# Altium schematic sheet SCH3_Microcontroller.SchDoc
size B; Organization: CWRUbotix; Address1: 10900 Euclid Avenue; Address2: Cleveland, OH 44106; Address3: USA
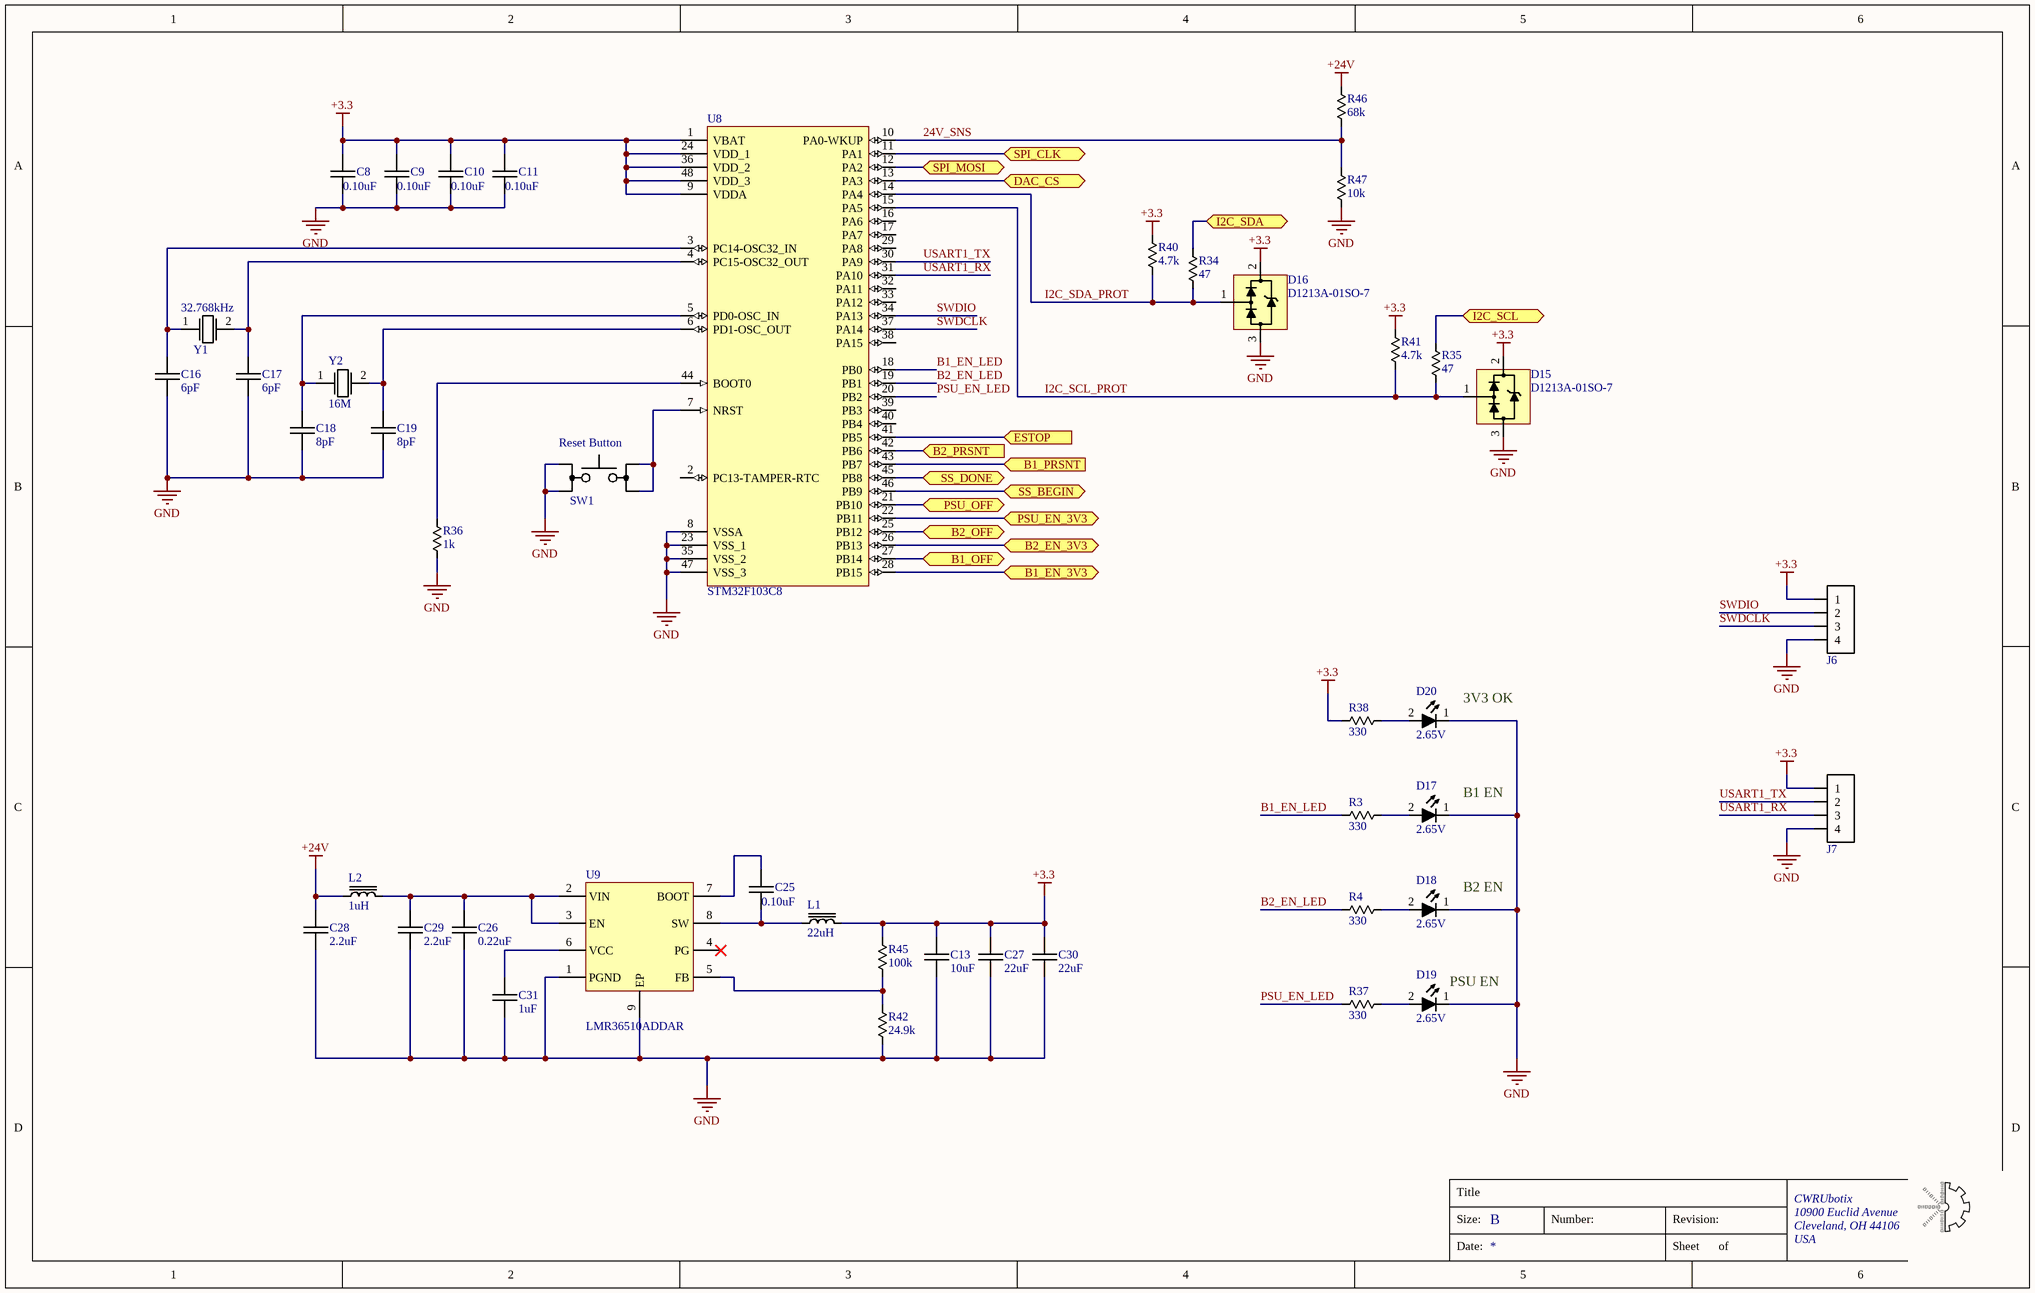
[diagram p0: SCH3_Microcontroller.SchDoc]

## Parts
C8  0.10uF  [chip_0805]
C9  0.10uF  [chip_0805]
C10  0.10uF  [chip_0805]
C11  0.10uF  [chip_0805]
C13  10uF  [chip_1206]
C16  6pF  [chip_0603]
C17  6pF  [chip_0603]
C18  8pF  [chip_0603]
C19  8pF  [chip_0603]
C25  0.10uF  [chip_0805]
C26  0.22uF  [chip_0805]
C27  22uF  [chip_1206]
C28  2.2uF  [chip_1206]
C29  2.2uF  [chip_1206]
C30  22uF  [chip_1206]
C31  1uF  [chip_0805]
D15  D1213A-01SO-7  [SOT-23-3_1]
D16  D1213A-01SO-7  [SOT-23-3_1]
D17  2.65V  [chip_0603_LED]
D18  2.65V  [chip_0603_LED]
D19  2.65V  [chip_0603_LED]
D20  2.65V  [chip_0603_LED]
J6  conn-4x1_0  [HDDR_4x1_0]  (value not drawn)
J7  conn-4x1_0  [HDDR_4x1_0]  (value not drawn)
L1  22uH  [BOURNS_SRN5040]
L2  1uH  [chip_0805]
R3  330  [chip_0805]
R4  330  [chip_0805]
R34  47  [chip_0805]
R35  47  [chip_0805]
R36  1k  [chip_0805]
R37  330  [chip_0805]
R38  330  [chip_0805]
R40  4.7k  [chip_0805]
R41  4.7k  [chip_0805]
R42  24.9k  [chip_0805]
R45  100k  [chip_0805]
R46  68k  [chip_0805]
R47  10k  [chip_0805]
SW1  SW_1P1T_2  [TE_CONN_3-1825910-5]  (value not drawn)
U8  STM32F103C8  [LQFP48_0]
U9  LMR36510ADDAR  [SO-8_PPAD]
Y1  osc_xtal_2p_0  [ABS25_OSC]  (value not drawn)
Y2  16M  [NX5032GA]

## Ports
B1_EN_3V3 (bidir), B1_OFF (bidir), B1_PRSNT (in), B2_EN_3V3 (bidir), B2_OFF (bidir), B2_PRSNT (in), DAC_CS (bidir), ESTOP (in), I2C_SCL (bidir), I2C_SDA (bidir), PSU_EN_3V3 (bidir), PSU_OFF (bidir), SPI_CLK (bidir), SPI_MOSI (bidir), SS_BEGIN (bidir), SS_DONE (bidir)

## Nets
+3.3: C8.1 C9.1 C10.1 C11.1 C13.1 C27.1 C30.1 D15.2(VCC) D16.2(VCC) J6.1 J7.1 L1.2 R38.1 R40.1 R41.1 R45.2 U8.1(VBAT) U8.9(VDDA) U8.24(VDD_1) U8.36(VDD_2) U8.48(VDD_3)
+24V: C28.1 L2.1 R46.1
GND: C8.2 C9.2 C10.2 C11.2 C13.2 C16.2 C17.2 C18.2 C19.2 C26.2 C27.2 C28.2 C29.2 C30.2 C31.2 D15.3(GND) D16.3(GND) D17.1 D18.1 D19.1 D20.1 J6.4 J7.4 R36.2 R42.2 R47.2 SW1.1 SW1.2 U8.8(VSSA) U8.23(VSS_1) U8.35(VSS_2) U8.47(VSS_3) U9.1(PGND) U9.9(EP)
24V_SNS: R46.2 R47.1 U8.10(PA0-WKUP)
B1_EN_3V3: U8.28(PB15) ; port B1_EN_3V3
B1_EN_LED: R3.1 U8.18(PB0)
B1_OFF: U8.27(PB14) ; port B1_OFF
B1_PRSNT: U8.43(PB7) ; port B1_PRSNT
B2_EN_3V3: U8.26(PB13) ; port B2_EN_3V3
B2_EN_LED: R4.1 U8.19(PB1)
B2_OFF: U8.25(PB12) ; port B2_OFF
B2_PRSNT: U8.42(PB6) ; port B2_PRSNT
DAC_CS: U8.13(PA3) ; port DAC_CS
ESTOP: U8.41(PB5) ; port ESTOP
I2C_SCL: R35.2 ; port I2C_SCL
I2C_SCL_PROT: D15.1(LINE) R35.1 R41.2 U8.15(PA5)
I2C_SDA: R34.2 ; port I2C_SDA
I2C_SDA_PROT: D16.1(LINE) R34.1 R40.2 U8.14(PA4)
PSU_EN_3V3: U8.22(PB11) ; port PSU_EN_3V3
PSU_EN_LED: R37.1 U8.20(PB2)
PSU_OFF: U8.21(PB10) ; port PSU_OFF
SPI_CLK: U8.11(PA1) ; port SPI_CLK
SPI_MOSI: U8.12(PA2) ; port SPI_MOSI
SS_BEGIN: U8.46(PB9) ; port SS_BEGIN
SS_DONE: U8.45(PB8) ; port SS_DONE
SWDCLK: J6.3 U8.37(PA14)
SWDIO: J6.2 U8.34(PA13)
USART1_RX: J7.3 U8.31(PA10)
USART1_TX: J7.2 U8.30(PA9)
NetC16_1: C16.1 U8.3(PC14-OSC32_IN) Y1.1
NetC17_1: C17.1 U8.4(PC15-OSC32_OUT) Y1.2
NetC18_1: C18.1 U8.5(PD0-OSC_IN) Y2.1
NetC19_1: C19.1 U8.6(PD1-OSC_OUT) Y2.2
NetC25_1: C25.1 U9.7(BOOT)
NetC25_2: C25.2 L1.1 U9.8(SW)
NetC26_1: C26.1 C29.1 L2.2 U9.2(VIN) U9.3(EN)
NetC31_1: C31.1 U9.6(VCC)
NetD17_2: D17.2 R3.2
NetD18_2: D18.2 R4.2
NetD19_2: D19.2 R37.2
NetD20_2: D20.2 R38.2
NetR36_1: R36.1 U8.44(BOOT0)
NetR42_1: R42.1 R45.1 U9.5(FB)
NetSW1_3: SW1.3 SW1.4 U8.7(NRST)

Not connected (* = marked no-connect by the designer): U8 2(PC13-TAMPER-RTC) 16(PA6) 17(PA7) 29(PA8) 32(PA11) 33(PA12) 38(PA15) 39(PB3) 40(PB4); U9 4(PG)*

## Notes on the sheet
- (near Y1) 32.768kHz
- (near SW1) Reset Button
- (near D20) 3V3 OK
- (near D17) B1 EN
- (near D18) B2 EN
- (near D19) PSU EN
- Title
- Size:
- B
- Number:
- Revision:
- Date:
- Sheet
- of

## Library data of the parts
C8-C11 C25 = CAP-00069: CAP, 0.10uF, 10%, 16V, X7R, 0805; Manufacturer: Murata; Manufacturer PN: GRM219R71C104KA01D; Part Number: CAP-00069; Capacitance: 0.10uF; Tolerance: 10%; Voltage Rating: 16V; Type: X7R
C13 = CAP-00539: CAP, 10uF, ±10%, 25V, X7R, 1206; Manufacturer: Samsung; Manufacturer PN: CL31B106KAHNNNE; Part Number: CAP-00539; Capacitance: 10uF; Tolerance: ±10%; Voltage Rating: 25V; Type: X7R
C16 C17 = CAP-00538: CAP, 6pF, ±10%, 50V, C0G, 0603; Part Number: CAP-00538; Capacitance: 6pF; Tolerance: ±10%; Voltage Rating: 50V; Type: C0G
C18 C19 = CAP-00402: CAP, 8pF, ±0.1pF, 50V, C0G, 0603; Manufacturer: Murata; Manufacturer PN: GRM1885C1H8R0BA01D; Part Number: CAP-00402; Capacitance: 8pF; Tolerance: ±0.1pF; Voltage Rating: 50V; Type: C0G
C26 = CAP-00080: CAP, 0.22uF, 10%, 100V, X7R, 0805; Manufacturer: Murata; Manufacturer PN: GRM21AR72A224KAC5K; Part Number: CAP-00080; Capacitance: 0.22uF; Tolerance: 10%; Voltage Rating: 100V; Type: X7R
C27 C30 = CAP-00587: CAP, 22uF, ±10%, 25V, X5R, 1206; Manufacturer: Samsung Electro-Mechanics; Manufacturer PN: CL31A226KAHNNNE; Part Number: CAP-00587; Capacitance: 22uF; Tolerance: ±10%; Voltage Rating: 25V; Type: X5R; Cost: $0.41
C28 C29 = CAP-00563: CAP, 2.2uF, ±10%, 50V, X7R, 1206; Manufacturer: KEMET; Manufacturer PN: C1206C225K5RACTU; Part Number: CAP-00563; Capacitance: 2.2uF; Tolerance: ±10%; Voltage Rating: 50V; Type: X7R; Cost: $0.33
C31 = CAP-00107: CAP, 1uF, 10%, 16V, X7R, 0805; Manufacturer: Murata; Manufacturer PN: GRM21BR71C105KA01L; Part Number: CAP-00107; Capacitance: 1uF; Tolerance: 10%; Voltage Rating: 16V; Type: X7R
D15 D16 = DIO-00075: TVS, Rail-Rail Steering + Zener Clamp, 3.3V Standoff, 10V Clamping; Manufacturer: Diodes Incorporated; Reverse Breakdown Voltage: 6V; Current Rating: 1A; Part Number: DIO-00075; Type: TVS; Manufacturer PN: D1213A-01SO-7; Cost: 0.35
D17-D20 = DIO-00049: LED, Blue, 0603, Low current, HELI2 Series; Manufacturer: Kingbright; Manufacturer PN: APT1608LVBC/D; Reverse Breakdown Voltage: 5V; Power Rating: 120mW; Current Rating: 30mA; Part Number: DIO-00049; Forward Voltage: 2.65V; Type: LED; Cost: 0.58
J6 J7 = CONN-00029: Header 4x1, 0.1"; Positions per level: 4; Levels: 1; Part Number: CONN-00029; Type: Header
L1 = MAG-00129: Ind, 10uH, 2.1A (2.3A sat.), 0.068 Ohm, SMD; Manufacturer: Bourns; Manufacturer PN: SRN5040-220M; Tolerance: 20%; Current Rating: 1.4A; DCR: 152mOhm; Part Number: MAG-00129; Inductance: 22uH; Cost: 0.46
L2 = MAG-00009: Ind, 1uH, 20%, 900mA, 0805; Manufacturer: TDK; Manufacturer PN: MLZ2012A1R0M; DCR: 100 mOhm; Part Number: MAG-00009; Inductance: 1uH; Tolerance: 20%; Current Rating: 900mA
R3 R4 R37 R38 = RES-00222: RES SMD 330 OHM 1% 1/8W 0805; Manufacturer: Rohm Semiconductor; Manufacturer PN: KTR10EZPF3300; Power Rating: 0.125W; Part Number: RES-00222; Resistance: 330; Tolerance: 1%
R34 R35 = RES-00154: RES SMD 47 OHM 1% 1/8W 0805; Manufacturer: Rohm Semiconductor; Manufacturer PN: KTR10EZPF47R0; Power Rating: 0.125W; Part Number: RES-00154; Resistance: 47; Tolerance: 1%
R36 = RES-00361: RES SMD 1K OHM 1% 1/8W 0805; Manufacturer: Rohm Semiconductor; Manufacturer PN: KTR10EZPF1001; Power Rating: 0.125W; Part Number: RES-00361; Resistance: 1k; Tolerance: 1%
R40 R41 = RES-00471: RES SMD 4.7K OHM 1% 1/8W 0805; Manufacturer: Rohm Semiconductor; Manufacturer PN: KTR10EZPF4701; Power Rating: 0.125W; Part Number: RES-00471; Resistance: 4.7k; Tolerance: 1%
R42 = RES-00396: RES SMD 24.9K OHM 1% 1/8W 0805; Manufacturer: Rohm Semiconductor; Manufacturer PN: KTR10EZPF2492; Power Rating: 0.125W; Part Number: RES-00396; Resistance: 24.9k; Tolerance: 1%
R45 = RES-00302: RES SMD 100K OHM 1% 1/8W 0805; Manufacturer: Rohm Semiconductor; Manufacturer PN: KTR10EZPF1003; Power Rating: 0.125W; Part Number: RES-00302; Resistance: 100k; Tolerance: 1%
R46 = RES-00724: RES SMD 68K OHM 1% 1/8W 0805 100ppm; Manufacturer: Yageo; Manufacturer PN: RC0805FR-0768KL; Part Number: RES-00724; Resistance: 68k; Tolerance: 1%; Power Rating: 1/8W; Cost: 0.1
R47 = RES-00307: RES SMD 10K OHM 1% 1/8W 0805; Manufacturer: Rohm Semiconductor; Manufacturer PN: KTR10EZPF1002; Power Rating: 0.125W; Part Number: RES-00307; Resistance: 10k; Tolerance: 1%
SW1 = MISC-00059: Switch, Tactile, SPST-NO, 50mA 24V, Vertical, Thru-Hole; Manufacturer: TE Connectivity; Manufacturer PN: 3-1825910-5; Part Number: MISC-00059; Cost: 0.13
U8 = UCTRL-00008: STM32 M3, LQFP-48; Manufacturer: ST; Part Number: UCTRL-00008; Manufacturer PN: STM32F103C8
U9 = PWREG-00076: REG, Synchronous Buck, 4.2V~65V, 1A, Simple Switcher; Manufacturer: TI; Voltage Range In: 4.2 ~ 65V; Voltage Range Out: 1V ~ 28V; Reg Type: SW Buck; Fixed/Adj: Adj; Part Number: PWREG-00076; Max Current: 1A; Manufacturer PN: LMR36510ADDAR; Cost: 2.35; Distributor Link: https://www.digikey.com/en/products/detail/texas-instruments/LMR36510ADDAR/11635685
Y1 = OSC-00003: XTAL, 32.768kHz, 6pF, 20ppm; Manufacturer: Abracon; Manufacturer PN: ABS25-32.768KHZ-6-T; ESR: 50k; Part Number: OSC-00003; Frequency: 32.768k; Load Capacitance: 6pF; Tolerance: 20ppm
Y2 = OSC-00000: XTAL, 16MHz, 8pF, 50, 20ppm; Manufacturer: NDK; Manufacturer PN: NX5032GA-16MHZ-STD-CSK-4; ESR: 50; Stability: 30ppm; Part Number: OSC-00000; Frequency: 16M; Load Capacitance: 8pF; Tolerance: 20ppm; Cost: 0.65